# EasyEDA schematic USB-Serial-IO-MCP2221.json
TITLE: USB-Serial-IO-B.01.00; REV: 1.0; Date: 2022-09-19; Sheet: 1/1; Drawn By: helmut-f; Company: Your Company
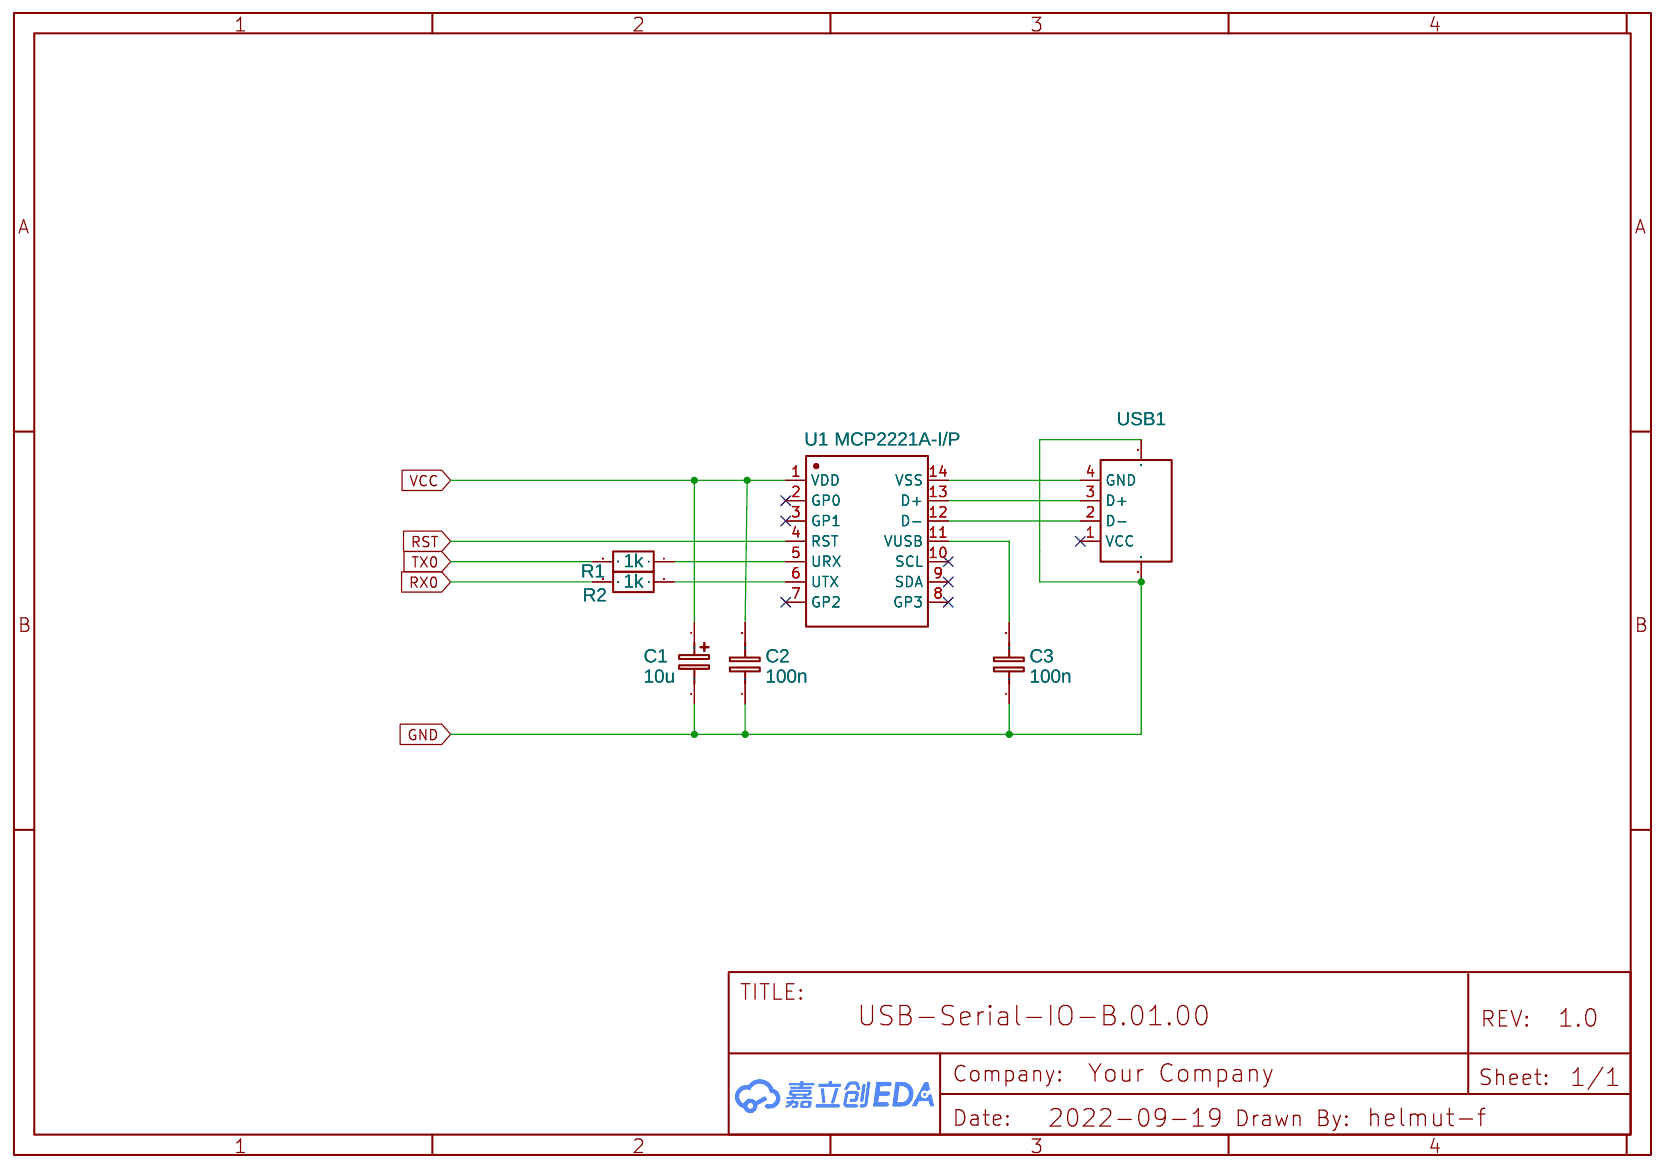
[diagram p0: schematic sheet]

## Parts
C1  10u  [CAP-D4.0×F1.5]
C2  100n  [RAD-0.2]
C3  100n  [RAD-0.2]
R1  1k  [R_AXIAL-0.3]
R2  1k  [R_AXIAL-0.3]
U1  MCP2221A-I/P  [DIP14]
USB1  USB-Type A_Male  [USB-A-TH_48037-0001]

## Library data of the parts
C1 = CE_TH_D4.0×F1.5_EU: Contributor: LCEDA_Lib
C2 C3 = C_0603_EU: Contributor: LCEDA_Lib
R1 R2 = R_AXIAL-0.3_EU: Contributor: LCEDA_Lib
U1 = MCP2221A-I/P
USB1 = USB-Type A_Male: Supplier Part: C112454; Supplier: LCSC; Manufacturer: SOFNG; Manufacturer Part: USB-05; Contributor: LCEDA_Lib

## Nets
GND: C1.2 C2.1 C3.1 USB1.5 USB1.6
VCC: C1.1 C2.2 U1.1(VDD)
RST: U1.4(RST)
RX0: R2.2
TX0: R1.2
Net-(C3-2): C3.2 U1.11(VUSB)
Net-(R1-1): R1.1 U1.5(URX)
Net-(R2-1): R2.1 U1.6(UTX)
Net-(U1-12): U1.12(D-) USB1.2(D-)
Net-(U1-13): U1.13(D+) USB1.3(D+)
Net-(U1-14): U1.14(VSS) USB1.4(GND)

Not connected (* = marked no-connect by the designer): U1 2(GP0)* 3(GP1)* 7(GP2)* 8(GP3)* 9(SDA)* 10(SCL)*; USB1 1(VCC)*
